# EAGLE design LED-controller-4 (EAGLE 7.6.0)
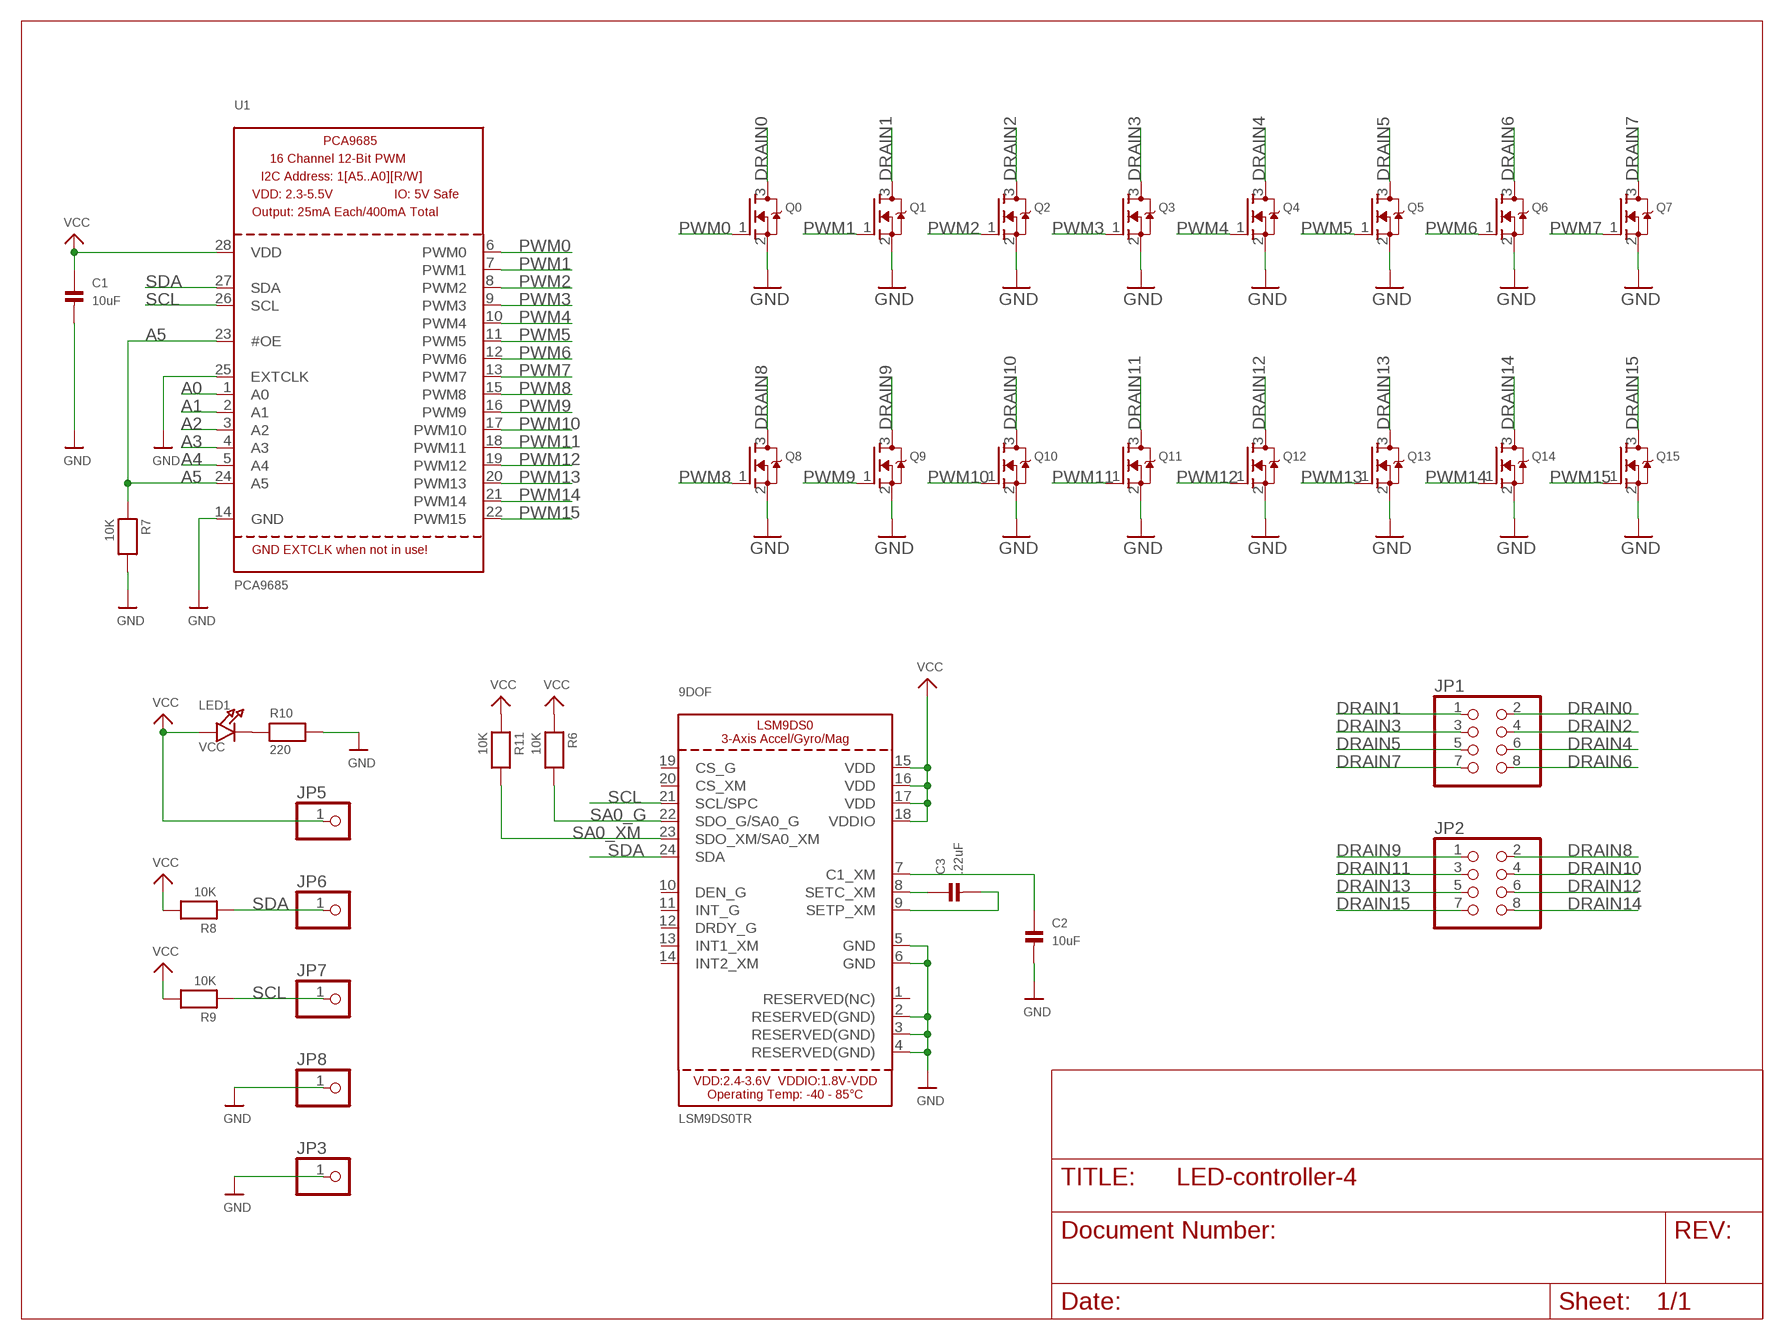
[diagram p0: schematic, sheet 1]

## Parts
9DOF  LSM9DS0TR  LSM9DS0  [LGA24_4X4MM]
C1  10uF  CAP_CERAMIC0805  [0805]
C2  10uF  CAP_CERAMIC0805  [0805]
C3  .22uF  CAP_CERAMIC0805  [0805]
JP1  PINHD-2X4  [2X04]
JP2  PINHD-2X4  [2X04]
JP3  PINHD-1X1CB  [1X01-CLEANBIG]
JP5  PINHD-1X1CB  [1X01-CLEANBIG]
JP6  PINHD-1X1CB  [1X01-CLEANBIG]
JP7  PINHD-1X1CB  [1X01-CLEANBIG]
JP8  PINHD-1X1CB  [1X01-CLEANBIG]
LED1  VCC  LED0805  [CHIPLED_0805]
Q0  MOSFET-NREFLOW  [SOT23]
Q1  MOSFET-NREFLOW  [SOT23]
Q2  MOSFET-NREFLOW  [SOT23]
Q3  MOSFET-NREFLOW  [SOT23]
Q4  MOSFET-NREFLOW  [SOT23]
Q5  MOSFET-NREFLOW  [SOT23]
Q6  MOSFET-NREFLOW  [SOT23]
Q7  MOSFET-NREFLOW  [SOT23]
Q8  MOSFET-NREFLOW  [SOT23]
Q9  MOSFET-NREFLOW  [SOT23]
Q10  MOSFET-NREFLOW  [SOT23]
Q11  MOSFET-NREFLOW  [SOT23]
Q12  MOSFET-NREFLOW  [SOT23]
Q13  MOSFET-NREFLOW  [SOT23]
Q14  MOSFET-NREFLOW  [SOT23]
Q15  MOSFET-NREFLOW  [SOT23]
R6  10K  RESISTOR0603  [0603]
R7  10K  RESISTOR0603  [0603]
R8  10K  RESISTOR0603  [0603]
R9  10K  RESISTOR0603  [0603]
R10  220  RESISTOR0603  [0603]
R11  10K  RESISTOR0603  [0603]
U1  PCA9685  [TSSOP28]

## Nets
A0: U1.1(A0)
A1: U1.2(A1)
A2: U1.3(A2)
A3: U1.4(A3)
A4: U1.5(A4)
A5: R7.1 U1.23(#OE) U1.24(A5)
DRAIN0: JP1.2 Q0.3(D)
DRAIN1: JP1.1 Q1.3(D)
DRAIN2: JP1.4 Q2.3(D)
DRAIN3: JP1.3 Q3.3(D)
DRAIN4: JP1.6 Q4.3(D)
DRAIN5: JP1.5 Q5.3(D)
DRAIN6: JP1.8 Q6.3(D)
DRAIN7: JP1.7 Q7.3(D)
DRAIN8: JP2.2 Q8.3(D)
DRAIN9: JP2.1 Q9.3(D)
DRAIN10: JP2.4 Q10.3(D)
DRAIN11: JP2.3 Q11.3(D)
DRAIN12: JP2.6 Q12.3(D)
DRAIN13: JP2.5 Q13.3(D)
DRAIN14: JP2.8 Q14.3(D)
DRAIN15: JP2.7 Q15.3(D)
GND: 9DOF.2(RESERVED(GND)) 9DOF.3(RESERVED(GND)) 9DOF.4(RESERVED(GND)) 9DOF.5(GND) 9DOF.6(GND) C1.2 C2.2 JP3.1 JP8.1 Q0.2(S) Q1.2(S) Q2.2(S) Q3.2(S) Q4.2(S) Q5.2(S) Q6.2(S) Q7.2(S) Q8.2(S) Q9.2(S) Q10.2(S) Q11.2(S) Q12.2(S) Q13.2(S) Q14.2(S) Q15.2(S) R7.2 R10.2 U1.14(GND) U1.25(EXTCLK)
N$1: LED1.C R10.1
N$2: 9DOF.8(SETC_XM) C3.1
N$3: 9DOF.9(SETP_XM) C3.2
N$6: 9DOF.7(C1_XM) C2.1
PWM0: Q0.1(G) U1.6(PWM0)
PWM1: Q1.1(G) U1.7(PWM1)
PWM2: Q2.1(G) U1.8(PWM2)
PWM3: Q3.1(G) U1.9(PWM3)
PWM4: Q4.1(G) U1.10(PWM4)
PWM5: Q5.1(G) U1.11(PWM5)
PWM6: Q6.1(G) U1.12(PWM6)
PWM7: Q7.1(G) U1.13(PWM7)
PWM8: Q8.1(G) U1.15(PWM8)
PWM9: Q9.1(G) U1.16(PWM9)
PWM10: Q10.1(G) U1.17(PWM10)
PWM11: Q11.1(G) U1.18(PWM11)
PWM12: Q12.1(G) U1.19(PWM12)
PWM13: Q13.1(G) U1.20(PWM13)
PWM14: Q14.1(G) U1.21(PWM14)
PWM15: Q15.1(G) U1.22(PWM15)
SA0_G: 9DOF.22(SDO_G/SA0_G) R6.2
SA0_XM: 9DOF.23(SDO_XM/SA0_XM) R11.2
SCL: 9DOF.21(SCL/SPC) JP7.1 R9.1 U1.26(SCL)
SDA: 9DOF.24(SDA) JP6.1 R8.1 U1.27(SDA)
VCC: 9DOF.15(VDD) 9DOF.16(VDD) 9DOF.17(VDD) 9DOF.18(VDDIO) C1.1 JP5.1 LED1.A R6.1 R8.2 R9.2 R11.1 U1.28(VDD)
Unconnected: 9DOF.1(RESERVED(NC)) 9DOF.10(DEN_G) 9DOF.11(INT_G) 9DOF.12(DRDY_G) 9DOF.13(INT1_XM) 9DOF.14(INT2_XM) 9DOF.19(CS_G) 9DOF.20(CS_XM)

## Library data of the parts
9DOF = microbuilder:LSM9DS0: LSM9DS0 3-Axis Accelerometer/Gyroscope/Magnetometer ±2/±4/±6/±8/±16 g linear acceleration ±2/±4/±8/±12 gauss magnetic ±245/±500/±2000 dps angular rate I2C/SPI Interface 2.4-3.6V Supply, 1.8V - VDD Logic
C1-C3 = microbuilder:CAP_CERAMIC: Ceramic Capacitors 0402 - 0402 Surface Mount Capacitors 16pF 50V 5% [Digikey: 445-4899-2-ND] 18pF 50V 5% [Digikey: 490-1281-2-ND] 22pF 50V 5% [Digikey: 490-1283-2-ND] 68pF 50V 5% [Digikey: 490-1289-2-ND] 0.1uF 10V 10% [Digikey: 490-1318-2-ND] 1.0uF 6.3V 10% [Digikey: 490-1320-2-ND] 0603 - 0603 Surface Mount Capacitors 16 pF 50V 5% [Digikey: 445-5051-2-ND] 22 pF 50V [Digikey: PCC220ACVTR-ND] 33 pF 50V 5% [Digikey: 490-1415-1-ND] 56pF 50V 5% [Digikey: 490-1421-1-ND] 220pF 50V 5% [Digikey: 445-1285-1-ND] 680 pF 50V 2200 pF 50V 5% C0G [Digikey: 445-1297-1-ND] 5600 pF 100V 5% X7R [Digikey: 478-3711-1-ND] 0.1 µF 25V 10% [Digikey: PCC2277TR-ND] 0.22 µF 16V 10% X7R [Digikey: 445-1318-1-ND] 1.0 µF 25V 10% [Digikey: 445-5146-2-ND] 0603 - RF Specific 3pF 250V +/-0.1pF RF [Digikey: 712-1347-1-ND] 18 pF 250V 5% [Digikey: 478-3505-1-ND or 712-1322-1-ND] 56 pF 250V 5% C0G RF [Digikey: 490-4867-1-ND] 68 pF 250V RF [Digikey: 490-4868-1-ND] 0805 - 0805 Surface Mount Capacitors 220 pF 250V 2% RF Ceramic Capacitor [Digikey: 712-1398-1-ND] 1000 pF 50V 2% NP0 Ceramic Capacitor [Digikey: 478-3760-1-ND] 0.1 µF 25V 10% Ceramic Capacitor [Digikey: PCC1828TR-ND] 1.0 µF 16V 10% Ceramic Capacitor[Digikey: 490-1691-2-ND] 10.0 µF 10V 10% Ceramic Capacitor[Digikey: 709-1228-1-ND] 10.0 uF 16V 10% Ceramic Capacitor [Digikey: 478-5165-2-ND] 47 uF 6.3V 20% Ceramic Capacitor [Digikey: 587-1779-1-ND or 399-5506-1-ND] 1206 - 1206 Surface Mount Capacitors 47uF 10V 20% Ceramic Capacitor [Digikey: 490-5528-1-ND or 399-5508-1-ND or 445-6010-1-ND] 100uF 6.3V -20%, +80% Y5V Ceramic Capacitor (Digikey: 490-4512-1-ND, Mouser: 81-GRM31CF50J107ZE1L)
JP1 JP2 = adafruit:PINHD-2X4: PIN HEADER
JP3 JP5-JP8 = adafruit:PINHD-1X1: Pin header 1x1 for 0.1" spacing With round pins
LED1 = microbuilder:LED: LED 0603 - 0603 Surface Mount Package 2mA: Green LED - Low Power (3.9mcd, 2ma, 1.7Vf) - Digikey: 475-2709-2-ND Orange LED - Low Power (9.8mcd, 2ma, 1.8Vf) - Digikey: 475-1194-2-ND Red LED - Low Power (5mcd, 2ma, 1.8Vf) - Digikey: 475-1195-2-ND Yellow LED - Low Power (7mcd, 2ma, 1.8Vf) - Digikey: 475-1196-2-ND 5mA: Blue LED - Low Power (17mcd, 5ma, 2.9Vf) - Digikey: LNJ937W8CRACT-ND 0805 - 0805 Surface Mount Package 2mA: Red LED (8.8mcd, 2mA, 1.8Vf, Clear) - Low Power [Digikey: 475-2510-1-ND] Green LED (5mcd, 2mA, 1.8Vf, Clear) - Low Power [Digikey: 475-2730-1-ND] Yellow LED (11.3mcd, 2mA, 1.8Vf, Clear) - Low Power [Digikey: 475-2555-1-ND] 20mA: Red LED (104mcd, 20mA, Diffused) - LS R976 [Digikey: 475-1278-6-ND] Red LED (12mcd, 20mA, 2.0Vf, Clear) - APT2012EC [Digikey: 754-1128-1-ND] Green LED (15mcd, 20mA, 2.2Vf, Clear) - APT2012GC [Digikey: 754-1131-1-ND] Orange LED (160mcd, 20mA, 2.1Vf, Clear) - APT2012SECK [Digikey: 754-1130-1-ND] 1206 - 1206 Surface Mount Package Green LED (26mcd, 20mA, Diffused) - LG N971 [Digikey: 475-1407-6-ND] Red LED (15mcd, 20mA, Diffused) - LH N974 [Digikey: 475-1416-6-ND]
Q0 Q1-Q15 = adafruit:MOSFET-N: N-Channel Mosfet 2N7002E - 60V 260mA SOT23 [Digikey: 2N7002ET1GOSTR-ND] - REEL BSH103 - 30V 850mA SOT23 [Digikey: 568-5013-1-ND]
R6-R11 = microbuilder:RESISTOR: Resistors 0402 - 0402 Surface Mount Package 22 Ohm 1% 1/16W [Digikey: 311-22.0LRTR-ND] 33 Ohm 5% 1/16W 1.0K 5% 1/16W 1.5K 5% 1/16W 2.0K 1% 1/16W 10.0K 1% 1/16W [Digikey: 311-10.0KLRTR-ND] 10.0K 5% 1/16W [Digikey: RMCF0402JT10K0TR-ND] 12.1K 1% 1/16W [Digikey: 311-22.0LRTR-ND] 100.0K 5% 1/16W 0603 - 0603 Surface Mount Package 0 Ohm 1/10 Watt 1% Resistor 15 Ohm 1/10 Watt 1% Resistor 33 Ohm 1/10 Watt 1% Resistor 49.9 Ohm 1/10 Watt 1% Resistor 100 Ohm 1/10 Watt 1% Resistor 150 Ohm 1/10 Watt 1% Resistor 240 Ohm 1/10 Watt 1% Resistor 390 Ohm 1/10 Watt 1% Resistor 560 Ohm 1/10 Watt 1% Resistor 680 Ohm 1/10 Watt 1% Resistor 750 Ohm 1/10 Watt 1% Resistor 1.0K Ohm 1/10 Watt 1% Resistor 1.5K Ohm 1/10 Watt 1% Resistor 2.0K Ohm 1/10 Watt 1% Resistor 2.2K Ohm 1/10 Watt 1% Resistor 3.3K Ohm 1/10 Watt 1% Resistor 4.7K Ohm 1/10 Watt 1% Resistor 10.0K Ohm 1/10 Watt 1% Resistor 12.0K Ohm 1/10 Watt 1% Resistor 12.1K Ohm 1/10 Watt 1% Resistor 20.0K Ohm 1/10 Watt 1% Resistor 33.0K Ohm 1/10 Watt 1% Resistor 100.0K Ohm 1/10 Watt 1% Resistor 0805 - 0805 Surface Mount Package 0 Ohm 1/8 Watt 1% Resistor 33 Ohm 1/8 Watt 1% Resistor 100 Ohm 1/8 Watt 1% Resistor 150 Ohm 1/8 Watt 1% Resistor 200 Ohm 1/8 Watt 1% Resistor 240 Ohm 1/8 Watt 1% Resistor 330 Ohm 1/8 Watt 1% Resistor 390 Ohm 1/8 Watt 1% Resistor 470 Ohm 1/8 Watt 1% Resistor 1.0K Ohm 1/8 Watt 1% Resistor 1.5K Ohm 1/8 Watt 1% Resistor 2.0K Ohm 1/8 Watt 1% Resistor 4.7K Ohm 1/8 Watt 1% Resistor 5.1K Ohm 1/8 Watt 1% Resistor 5.6K Ohm 1/8 Watt 1% Resistor 10.0K Ohm 1/8 Watt 1% Resistor 22.0K Ohm 1/8 Watt 1% Resistor 33.0K Ohm 1/8 Watt 1% Resistor 100K Ohm 1/8 Watt 1% Resistor 1206 - 1206 Surface Mount Package 2012 - 2010 Surface Mount Package 0.11 Ohm 1/2 Watt 1% Resistor - Digikey: RHM.11UCT-ND
U1 = microbuilder:PCA9685: PCA9685 - 16 Channel 12-Bit I2C PWM Controller 5.0V tolerant 16 channel, 12-bit I2C PWM controller with 25mA per output (max. 400mA total) Digikey: 568-5931-1-ND

## Board
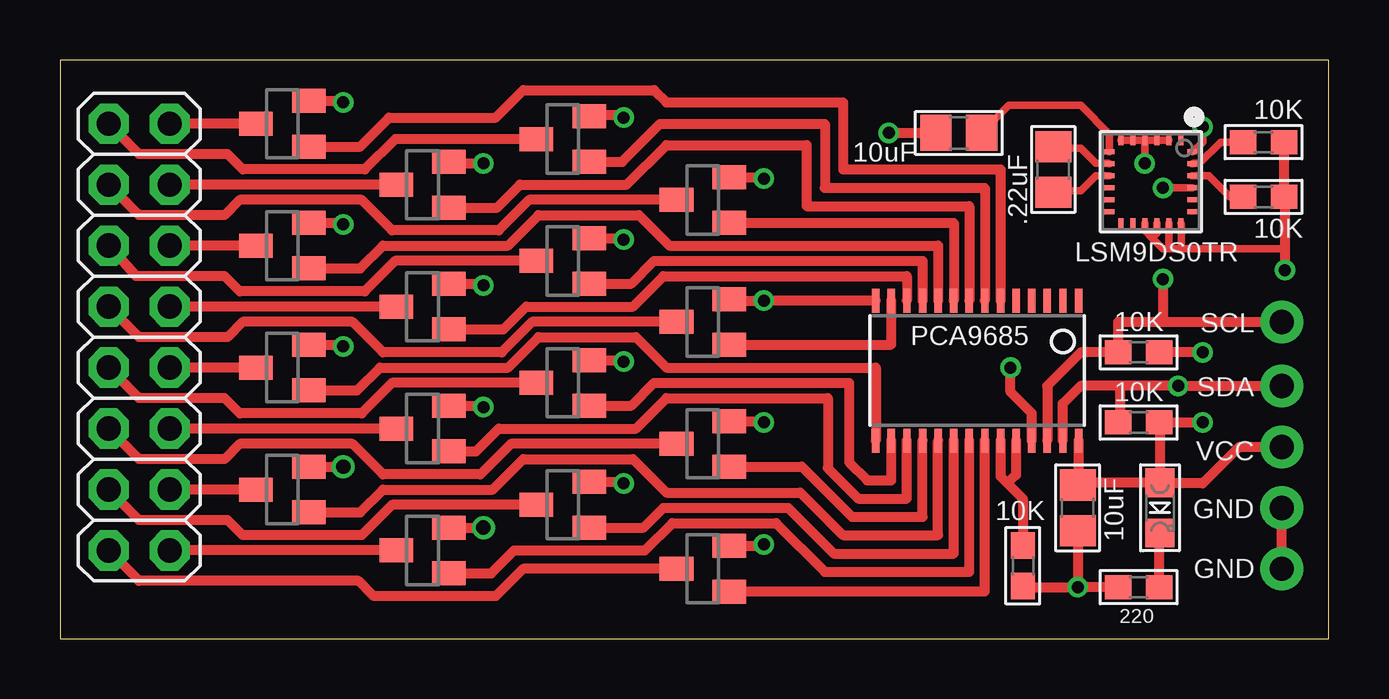
[diagram p1: board, top side]
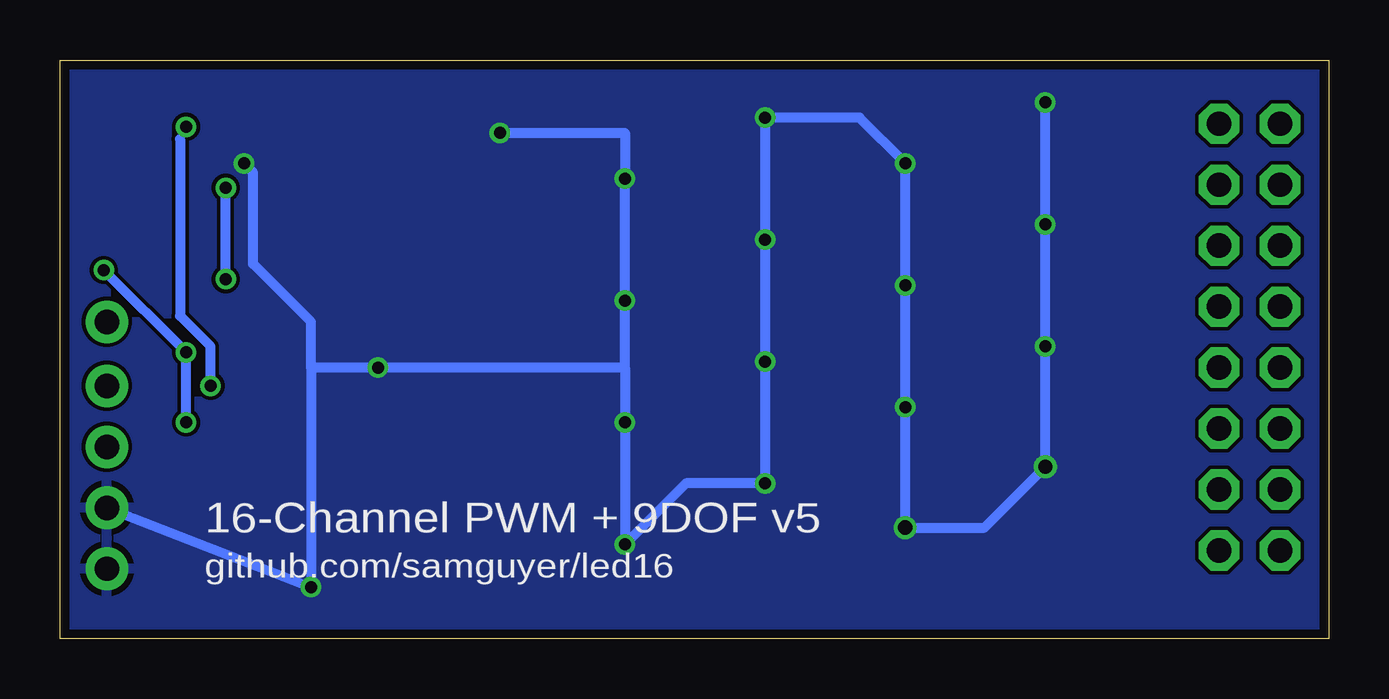
[diagram p2: board, bottom side, seen from below]

Size 52.88 x 24.12 mm. Coordinates in mm from the lower left corner, seen from the top.
Outline: 0,0 52.88,0 52.88,24.12 0,24.12 0,0
Copper layers (1*16): Top 0.0356mm / dielectric 1.5011mm / Bottom 0.0356mm
Design rules "LaenPCBOrder": minimum track width 6mil, minimum drill 13mil, track to track 6mil, track to pad 6mil, pad to pad 6mil, via to via 6mil, smd to smd 6mil, copper to edge 15mil, drill to drill 6mil, minimum pad ring 7mil, minimum via ring 7mil, stop-mask expansion 3mil, vias tented up to drill 0mil, thermal gap 10mil

### Footprints (pad centres in the part's own frame; a part is rotated, then mirrored left to right if it is on the bottom)
LGA24_4X4MM = smd 0.21 x 0.4: 1 -1.25,-1.725; 2 -0.75,-1.725; 3 -0.25,-1.725; 4 0.25,-1.725; 5 0.75,-1.725; 6 1.25,-1.725; 13 1.25,1.725; 14 0.75,1.725; 15 0.25,1.725; 16 -0.25,1.725; 17 -0.75,1.725; 18 -1.25,1.725 | smd 0.4 x 0.21: 7 1.725,-1.25; 8 1.725,-0.75; 9 1.725,-0.25; 10 1.725,0.25; 11 1.725,0.75; 12 1.725,1.25; 19 -1.725,1.25; 20 -1.725,0.75; 21 -1.725,0.25; 22 -1.725,-0.25; 23 -1.725,-0.75; 24 -1.725,-1.25
0805 = smd 1.3 x 1.5: 1 -0.95,0; 2 0.95,0
2X04 = drill 1.016 pad 1.676 octagon: 1 -3.81,-1.27; 2 -3.81,1.27; 3 -1.27,-1.27; 4 -1.27,1.27; 5 1.27,-1.27; 6 1.27,1.27; 7 3.81,-1.27; 8 3.81,1.27
1X01-CLEANBIG = drill 1.016 pad 1.778: 1 0,0
CHIPLED_0805 = smd 1.2 x 1.2: A 0,-1.05; C 0,1.05
SOT23 = smd 1 x 1.4: 1 -0.95,-1.1; 2 0.95,-1.1; 3 0,1.1
0603 = smd 1.1 x 1: 1 -0.85,0; 2 0.85,0
TSSOP28 = smd 0.305 x 0.991: 1 -4.225,-2.918; 2 -3.575,-2.918; 3 -2.925,-2.918; 4 -2.275,-2.918; 5 -1.625,-2.918; 6 -0.975,-2.918; 7 -0.325,-2.918; 8 0.325,-2.918; 9 0.975,-2.918; 10 1.625,-2.918; 11 2.275,-2.918; 12 2.925,-2.918; 13 3.575,-2.918; 14 4.225,-2.918; 15 4.225,2.918; 16 3.575,2.918; 17 2.925,2.918; 18 2.275,2.918; 19 1.625,2.918; 20 0.975,2.918; 21 0.325,2.918; 22 -0.325,2.918; 23 -0.975,2.918; 24 -1.625,2.918; 25 -2.275,2.918; 26 -2.925,2.918; 27 -3.575,2.918; 28 -4.225,2.918

### Placement (x,y rotation side)
9DOF  45.47,19.05 180 top
C1  42.42,5.46 270 top
C2  37.47,21.08 180 top
C3  41.4,19.56 270 top
JP1  3.3,17.65 270 top
JP2  3.3,7.49 270 top
JP3  50.93,2.92 0 top
JP5  50.93,8 0 top
JP6  50.93,10.54 0 top
JP7  50.93,13.21 0 top
JP8  50.93,5.46 0 top
LED1  45.85,5.46 180 top
Q0  9.27,21.46 90 top
Q1  20.95,20.83 90 top
Q2  15.11,18.92 90 top
Q3  26.8,18.29 90 top
Q4  9.27,16.38 90 top
Q5  20.95,15.75 90 top
Q6  15.11,13.84 90 top
Q7  26.8,13.21 90 top
Q8  9.27,11.3 90 top
Q9  20.95,10.67 90 top
Q10  15.11,8.76 90 top
Q11  26.8,8.13 90 top
Q12  9.27,6.22 90 top
Q13  20.95,5.59 90 top
Q14  15.11,3.68 90 top
Q15  26.8,2.92 90 top
R6  50.16,18.41 180 top
R7  40.13,3.05 270 top
R8  44.96,9.02 0 top
R9  44.96,11.94 0 top
R10  44.96,2.16 180 top
R11  50.16,20.7 180 top
U1  38.23,11.18 180 top

### Tracks (layer width: path | path; a pad name or v marks a point on that pad's centre or on a via)
A5
  Top 0.406: U1.23 39.2,6.77 39.5,6.48 | 39.5,6.48 40.13,5.84 R7.1 | U1.24 39.85,6.83 39.5,6.48
DRAIN0
  Top 0.406: Q0.3 JP1.2
DRAIN1
  Top 0.406: Q1.3 13.97,20.83 12.7,19.56 7.62,19.56 6.98,20.19 3.3,20.19 JP1.1
DRAIN2
  Top 0.406: Q2.3 JP1.4
DRAIN3
  Top 0.406: Q3.3 19.56,18.29 18.29,17.02 13.84,17.02 12.57,18.29 7.49,18.29 6.86,17.65 3.3,17.65 JP1.3
DRAIN4
  Top 0.406: Q4.3 JP1.6
DRAIN5
  Top 0.406: Q5.3 13.97,15.75 12.7,14.48 7.49,14.48 6.86,15.11 3.17,15.11 JP1.5
DRAIN6
  Top 0.406: Q6.3 JP1.8
DRAIN7
  Top 0.406: Q7.3 19.68,13.21 18.41,11.94 13.46,11.94 12.19,13.21 7.62,13.21 6.98,12.57 3.3,12.57 JP1.7
DRAIN8
  Top 0.406: Q8.3 JP2.2
DRAIN9
  Top 0.406: Q9.3 13.84,10.67 12.57,9.4 7.49,9.4 6.86,10.03 3.3,10.03 JP2.1
DRAIN10
  Top 0.406: Q10.3 JP2.4
DRAIN11
  Top 0.406: Q11.3 18.8,8.13 17.53,6.86 13.46,6.86 12.19,8.13 7.49,8.13 6.86,7.49 3.3,7.49 JP2.3
DRAIN12
  Top 0.406: Q12.3 JP2.6
DRAIN13
  Top 0.406: Q13.3 13.84,5.59 12.57,4.32 7.62,4.32 6.98,4.95 3.3,4.95 JP2.5
DRAIN14
  Top 0.406: Q14.3 JP2.8
DRAIN15
  Top 0.406: Q15.3 19.3,2.92 18.16,1.78 13.08,1.78 12.45,2.41 3.3,2.41 JP2.7
GND  (via drill 0.5, 0.6)
  Top 0.305: v45.21,19.81 45.21,20.7 9DOF.4 | 9DOF.4 9DOF.3 9DOF.2 | 9DOF.4 9DOF.5 9DOF.6
  Top 0.406: Q7.2 27.94,14.1 v29.34,14.1 33.62,14.1 U1.14 | Q0.2 11.81,22.41 v11.81,22.35 | Q4.2 11.81,17.33 v11.81,17.27 | Q8.2 11.81,12.25 v11.81,12.19 | Q12.2 v11.81,7.17 | Q14.2 v17.65,4.63 | Q10.2 17.65,9.71 v17.65,9.65 | Q6.2 17.65,14.79 v17.65,14.73 | Q13.2 23.49,6.54 v23.49,6.48 | Q9.2 23.49,11.62 v23.49,11.56 | Q11.2 29.34,9.08 v29.34,9.02 | Q5.2 23.49,16.7 v23.49,16.64 | Q2.2 16.51,19.87 16.51,19.81 v17.65,19.81 | Q1.2 22.35,21.78 22.35,21.84 23.49,21.84 v23.49,21.72 | Q3.2 29.34,19.24 v29.34,19.18 | R10.2 v42.42,2.16 | C1.2 v42.42,2.16 | U1.25 40.5,9.41 39.62,10.29 v39.62,11.3 | 42.48,2.23 v42.42,2.16 | R7.2 40.13,2.16 v42.42,2.16 | Q15.2 29.27,3.87 v29.34,3.94 | v34.54,21.08 C2.2 | JP3.1 JP8.1
  Bottom 0.406: 29.34,11.3 v39.62,11.3 42.42,11.3 | 29.34,11.3 v29.34,19.18 29.34,21.08 v34.54,21.08 | 29.34,11.3 v29.34,3.94 26.8,6.48 v23.49,6.48 v23.49,21.72 19.56,21.72 v17.65,19.81 v17.65,4.63 14.35,4.63 v11.81,7.17 v11.81,22.35 | 42.42,11.3 v42.42,2.16 JP8.1 | 42.42,11.3 42.42,13.21 44.83,15.62 44.83,19.43 v45.21,19.81
  pour Bottom: 52.71,0.25 0.13,0.25 0.13,23.88 52.71,23.88
N$1
  Top 0.406: LED1.C 45.81,4.41 R10.1
N$2
  Top 0.305: C3.1 41.4,20.45 42.55,20.45 43.18,19.81 43.69,19.81 9DOF.8
N$3
  Top 0.305: C3.2 41.4,18.67 42.55,18.67 43.18,19.3 43.69,19.3 9DOF.9
N$6
  Top 0.305: C2.1 39.56,22.23 42.55,22.23 43.74,21.03 9DOF.7
PWM0
  Top 0.406: Q0.1 12.51,20.51 13.72,21.72 18.16,21.72 19.3,22.86 24.77,22.86 25.27,22.35 32.64,22.35 32.64,19.56 39.2,19.56 U1.6
PWM1
  Top 0.406: Q1.1 23.43,19.88 25.02,21.46 31.88,21.46 31.88,18.8 38.55,18.8 U1.7
PWM2
  Top 0.406: Q2.1 18.23,17.97 19.18,18.92 23.62,18.92 25.27,20.57 31.11,20.57 31.11,18.03 37.9,18.03 U1.8
PWM3
  Top 0.406: Q3.1 37.25,17.34 U1.9
PWM4
  Top 0.406: Q4.1 12.51,15.43 13.46,16.38 18.67,16.38 19.94,17.65 24.13,17.65 25.4,16.38 36.6,16.38 U1.10
PWM5
  Top 0.406: Q5.1 23.81,14.8 24.77,15.75 35.95,15.75 U1.11
PWM6
  Top 0.406: Q6.1 18.48,12.89 19.43,13.84 23.88,13.84 25.15,15.11 35.3,15.11 U1.12
PWM7
  Top 0.406: Q7.1 34.65,12.26 U1.13
PWM8
  Top 0.406: Q8.1 12.38,10.35 13.34,11.3 18.67,11.3 19.94,12.57 24,12.57 25.27,11.3 34,11.3 U1.15
PWM9
  Top 0.406: Q9.1 23.81,9.72 24.77,10.67 32.89,10.67 32.89,7.37 33.66,6.6 34.65,6.6 U1.16
PWM10
  Top 0.406: Q10.1 17.34,7.81 18.29,8.76 24,8.76 25.27,10.03 32,10.03 32,7.11 33.27,5.84 35.3,5.84 U1.17
PWM11
  Top 0.406: U1.18 35.95,5.08 33.02,5.08 30.92,7.18 Q11.1
PWM12
  Top 0.406: Q12.1 12.51,5.27 13.46,6.22 18.03,6.22 19.3,7.49 23.88,7.49 25.27,6.1 30.86,6.1 32.64,4.32 36.6,4.32 U1.19
PWM13
  Top 0.406: Q13.1 24.32,4.64 25.15,5.46 30.35,5.46 32.26,3.56 37.25,3.56 U1.20
PWM14
  Top 0.406: Q14.1 17.97,2.73 18.92,3.68 24.38,3.68 25.53,4.83 29.84,4.83 31.88,2.79 37.9,2.79 U1.21
PWM15
  Top 0.406: U1.22 38.55,1.97 Q15.1
SA0_G
  Top 0.305: R6.2 48.77,18.41 47.88,19.3 47.24,19.3 9DOF.22
SA0_XM
  Top 0.305: R11.2 48.39,20.7 47.5,19.81 47.24,19.81 9DOF.23
SCL  (via drill 0.5)
  Top 0.305: v45.97,18.8 47.12,18.8 9DOF.21
  Top 0.406: U1.26 41.15,10.54 42.55,11.94 R9.1 44.11,13.21 45.97,13.21 | 45.97,13.21 JP7.1 | v45.97,14.99 45.97,13.21
  Bottom 0.406: v45.97,14.99 v45.97,18.8
SDA  (via drill 0.5)
  Top 0.305: v47.62,21.34 47.62,20.7 47.24,20.32 9DOF.24
  Top 0.406: 44.2,10.54 v46.61,10.54 JP6.1 | 44.2,10.54 42.55,10.54 41.8,9.8 U1.27 | R8.1 44.2,9.02 44.2,10.54
  Bottom 0.305: v47.62,21.34 47.88,20.83
  Bottom 0.406: 47.88,20.83 47.88,13.46 46.61,12.19 v46.61,10.54
VCC  (via drill 0.5)
  Top 0.305: 46.23,16.26 45.97,16.26 45.53,16.7 | 46.23,16.26 46.74,16.26 | 46.74,16.26 51.05,16.26 | 45.53,16.7 45.21,17.02 45.21,17.27 9DOF.15 | 45.53,16.7 45.72,16.89 45.72,17.27 9DOF.16 | 46.23,16.26 46.23,17.27 9DOF.17 | 46.74,16.26 46.74,17.27 9DOF.18
  Top 0.406: LED1.A 45.75,6.48 47.62,6.48 49.15,8 JP5.1 | LED1.A 42.65,6.51 C1.1 42.45,6.45 U1.28 | v47.62,11.94 R9.2 | v47.62,9.02 R8.2 45.85,8.98 LED1.A | v51.05,15.37 51.05,16.26 51.05,18.38 R6.1 R11.1
  Bottom 0.406: v47.62,9.02 v47.62,11.94 v51.05,15.37

### Text on the board
tPlace: SCL | SDA | VCC | GND | GND
bPlace: 16-Channel PWM + 9DOF v5 | github.com/samguyer/led16